# EAGLE design PC-FX (EAGLE 9.6.2)
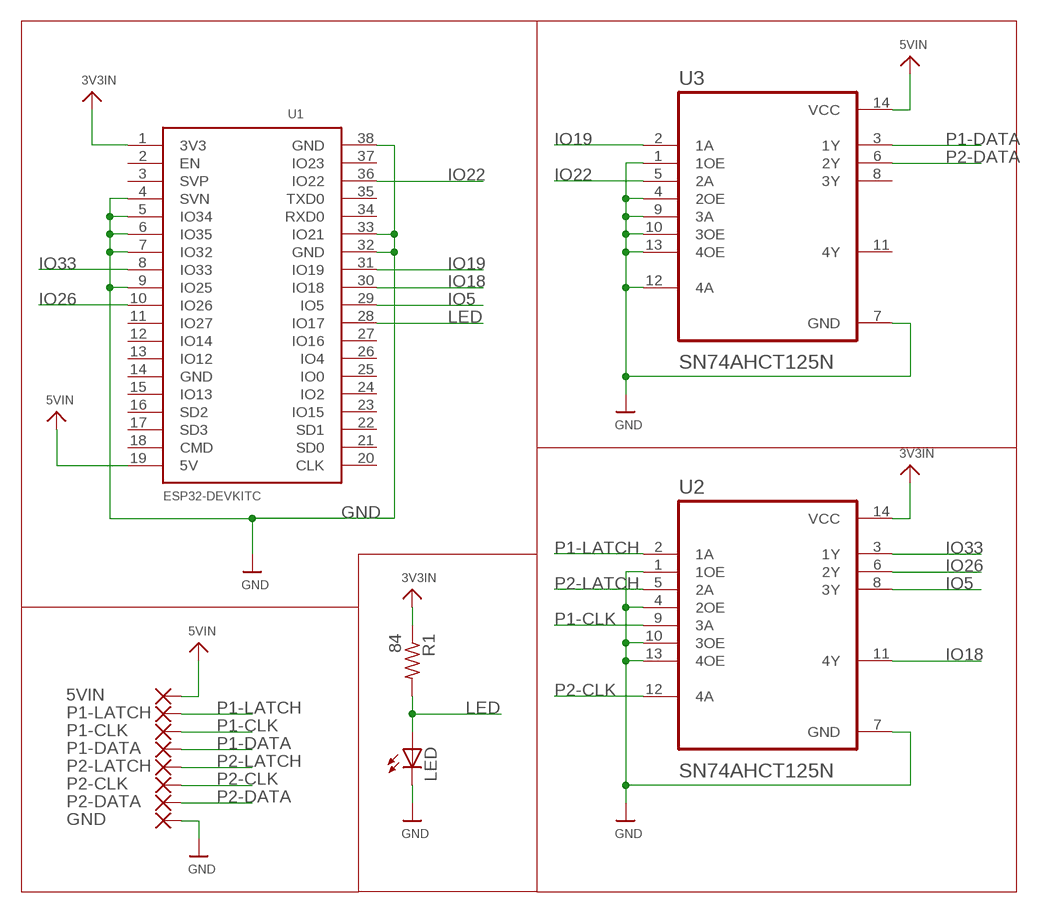
[diagram p0: schematic, sheet 1]

## Parts
5VIN  SMD5  [SMD2,54-5,08]
GND  SMD5  [SMD2,54-5,08]
LED  LEDCHIPLED_1206  [CHIPLED_1206]
P1-CLK  SMD5  [SMD2,54-5,08]
P1-DATA  SMD5  [SMD2,54-5,08]
P1-LATCH  SMD5  [SMD2,54-5,08]
P2-CLK  SMD5  [SMD2,54-5,08]
P2-DATA  SMD5  [SMD2,54-5,08]
P2-LATCH  SMD5  [SMD2,54-5,08]
R1  84  R-US_R1206  [R1206]
U1  ESP32DEVKITC  [ESP32-DEVKITC]
U2  SN74AHCT125N  [DIP794W45P254L1969H508Q14]
U3  SN74AHCT125N  [DIP794W45P254L1969H508Q14]

## Nets
3V3IN: R1.1 U1.1(3V3) U2.14(VCC)
5VIN: 5VIN.1(P) U1.19(5V) U3.14(VCC)
GND: GND.1(P) LED.C U1.4(SVN) U1.5(IO34) U1.6(IO35) U1.7(IO32) U1.9(IO25) U1.32(GND) U1.33(IO21) U1.38(GND) U2.1(1OE) U2.4(2OE) U2.7(GND) U2.10(3OE) U2.13(4OE) U3.1(1OE) U3.4(2OE) U3.7(GND) U3.9(3A) U3.10(3OE) U3.12(4A) U3.13(4OE)
IO5: U1.29(IO5) U2.8(3Y)
IO18: U1.30(IO18) U2.11(4Y)
IO19: U1.31(IO19) U3.2(1A)
IO22: U1.36(IO22) U3.5(2A)
IO26: U1.10(IO26) U2.6(2Y)
IO33: U1.8(IO33) U2.3(1Y)
LED: LED.A R1.2 U1.28(IO17)
P1-CLK: P1-CLK.1(P) U2.9(3A)
P1-DATA: P1-DATA.1(P) U3.3(1Y)
P1-LATCH: P1-LATCH.1(P) U2.2(1A)
P2-CLK: P2-CLK.1(P) U2.12(4A)
P2-DATA: P2-DATA.1(P) U3.6(2Y)
P2-LATCH: P2-LATCH.1(P) U2.5(2A)
Unconnected: U1.2(EN) U1.3(SVP) U1.11(IO27) U1.12(IO14) U1.13(IO12) U1.14(GND) U1.15(IO13) U1.16(SD2) U1.17(SD3) U1.18(CMD) U1.20(CLK) U1.21(SD0) U1.22(SD1) U1.23(IO15) U1.24(IO2) U1.25(IO0) U1.26(IO4) U1.27(IO16) U1.34(RXD0) U1.35(TXD0) U1.37(IO23) U3.8(3Y) U3.11(4Y)

## Library data of the parts
5VIN GND P1-CLK P1-DATA P1-LATCH P2-CLK P2-DATA P2-LATCH = wirepad:SMD5: SMD PAD
LED = adafruit:LED: LED OSRAM: - CHIPLED LG R971, LG N971, LY N971, LG Q971, LY Q971, LO R971, LY R971 LH N974, LH R974 LS Q976, LO Q976, LY Q976 LO Q996 - Hyper CHIPLED LW Q18S LB Q993, LB Q99A, LB R99A - SideLED LS A670, LO A670, LY A670, LG A670, LP A670 LB A673, LV A673, LT A673, LW A673 LH A674 LY A675 LS A676, LA A676, LO A676, LY A676, LW A676 LS A679, LY A679, LG A679 - Hyper Micro SIDELED® LS Y876, LA Y876, LO Y876, LY Y876 LT Y87S - SmartLED LW L88C, LW L88S LB L89C, LB L89S, LG L890 LS L89K, LO L89K, LY L89K LS L896, LA L896, LO L896, LY L896 - TOPLED LS T670, LO T670, LY T670, LG T670, LP T670 LSG T670, LSP T670, LSY T670, LOP T670, LYG T670 LG T671, LOG T671, LSG T671 LB T673, LV T673, LT T673, LW T673 LH T674 LS T676, LA T676, LO T676, LY T676, LB T676, LH T676, LSB T676, LW T676 LB T67C, LV T67C, LT T67C, LS T67K, LO T67K, LY T67K, LW E67C LS E67B, LA E67B, LO E67B, LY E67B, LB E67C, LV E67C, LT E67C LW T67C LS T679, LY T679, LG T679 LS T770, LO T770, LY T770, LG T770, LP T770 LB T773, LV T773, LT T773, LW T773 LH T774 LS E675, LA E675, LY E675, LS T675 LS T776, LA T776, LO T776, LY T776, LB T776 LHGB T686 LT T68C, LB T68C - Hyper Mini TOPLED® LB M676 - Mini TOPLED Santana® LG M470 LS M47K, LO M47K, LY M47K Source: http://www.osram.convergy.de/
R1 = adafruit:R-US_: RESISTOR, American symbol
U1 = ESP32-DEVKITC:ESP32DEVKITC
U2 U3 = SN74AHCT125N:SN74AHCT125N: None Check prices <https://pricing.snapeda.com/parts/SN74AHCT125N/Texas%20Instruments/view-part?ref=eda>; AVAILABILITY: In Stock; DESCRIPTION: Quadruple Bus Buffer Gates With 3-State Outputs 14-PDIP -40 to 125; MF: Texas Instruments; MP: SN74AHCT125N; PACKAGE: PDIP-14 Texas Instruments; PRICE: None; PURCHASE-URL: https://pricing.snapeda.com/search/part/SN74AHCT125N/?ref=eda

## Board
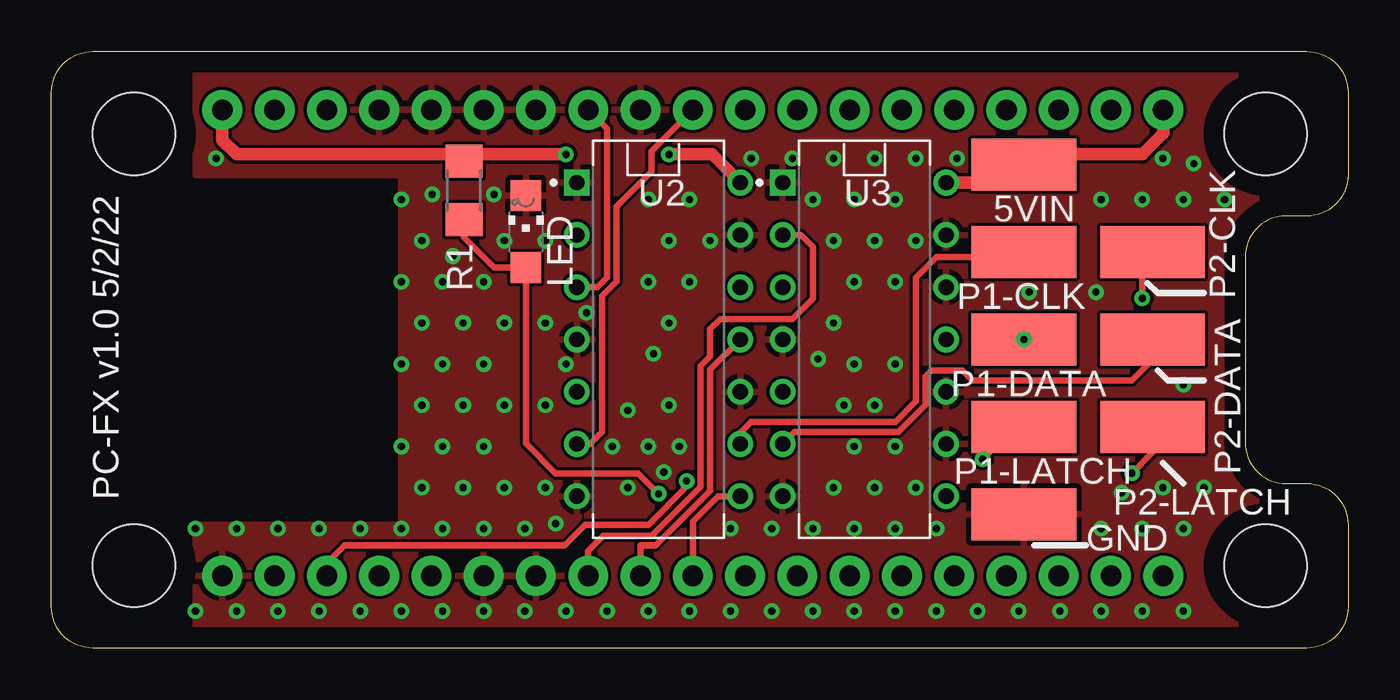
[diagram p1: board, top side]
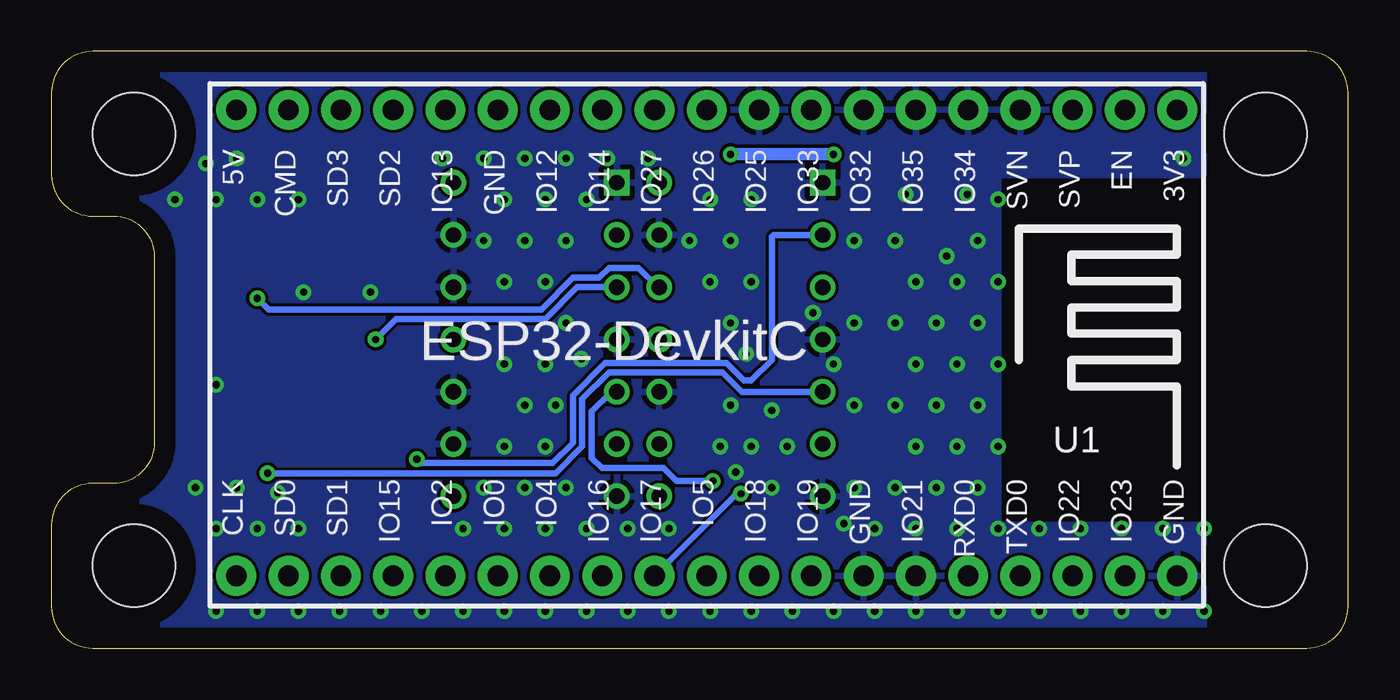
[diagram p2: board, bottom side, seen from below]

Size 63 x 29 mm. Coordinates in mm from the lower left corner, seen from the top.
Outline: 0,2 0,27 arc-90 2,29 61,29 arc-90 63,27 63,23 arc-90 61,21 60,21 arc90 58,19 58,10 arc90 60,8 61,8 arc-90 63,6 63,2 arc-90 61,0 2,0 arc-90 0,2
Copper layers (1*16): Top 0.035mm / dielectric 1.5mm / Bottom 0.035mm
Design rules "default": minimum track width 6mil, minimum drill 0.35mm, track to track 6mil, track to pad 6mil, pad to pad 6mil, via to via 6mil, smd to smd 6mil, copper to edge 40mil, drill to drill 6mil, minimum pad ring 10mil, minimum via ring 8mil, stop-mask expansion 4mil, vias tented up to drill 0.5mm, thermal gap 10mil
Holes 4 mm at 4,4 4,25 59,25 59,4

### Footprints (pad centres in the part's own frame; a part is rotated, then mirrored left to right if it is on the bottom)
SMD2,54-5,08 = smd 2.54 x 5.08: 1 0,0
CHIPLED_1206 = smd 1.5 x 1.5: A 0,-1.75; C 0,1.75
R1206 = smd 1.6 x 1.803: 1 -1.422,0; 2 1.422,0
ESP32-DEVKITC = drill 1 pad 1.93: 1 -22.87,-11.42; 2 -20.33,-11.42; 3 -17.79,-11.42; 4 -15.25,-11.42; 5 -12.71,-11.42; 6 -10.17,-11.42; 7 -7.63,-11.42; 8 -5.09,-11.42; 9 -2.55,-11.42; 10 -0.01,-11.42; 11 2.53,-11.42; 12 5.07,-11.42; 13 7.61,-11.42; 14 10.15,-11.42; 15 12.69,-11.42; 16 15.23,-11.42; 17 17.77,-11.42; 18 20.31,-11.42; 19 22.85,-11.42; 20 22.85,11.23; 21 20.31,11.23; 22 17.77,11.23; 23 15.23,11.23; 24 12.69,11.23; 25 10.15,11.23; 26 7.61,11.23; 27 5.07,11.23; 28 2.53,11.23; 29 -0.01,11.23; 30 -2.55,11.23; 31 -5.09,11.23; 32 -7.63,11.23; 33 -10.17,11.23; 34 -12.71,11.23; 35 -15.25,11.23; 36 -17.79,11.23; 37 -20.33,11.23; 38 -22.87,11.23
DIP794W45P254L1969H508Q14 = drill 0.74 pad 1.14 square: 1 -3.97,7.62 | drill 0.74 pad 1.14: 2 -3.97,5.08; 3 -3.97,2.54; 4 -3.97,0; 5 -3.97,-2.54; 6 -3.97,-5.08; 7 -3.97,-7.62; 8 3.97,-7.62; 9 3.97,-5.08; 10 3.97,-2.54; 11 3.97,0; 12 3.97,2.54; 13 3.97,5.08; 14 3.97,7.62

### Placement (x,y rotation side)
5VIN  47.25,23.5 90 top
GND  47.25,6.5 90 top
LED  23.05,20.24 0 top
P1-CLK  47.25,19.25 90 top
P1-DATA  47.25,15 90 top
P1-LATCH  47.25,10.75 90 top
P2-CLK  53.5,19.25 90 top
P2-DATA  53.5,15 90 top
P2-LATCH  53.5,10.75 90 top
R1  20.05,22.24 270 top
U1  31.17,14.74 180 bottom
U2  29.5,15 0 top
U3  39.5,15 0 top

### Tracks (layer width: path | path; a pad name or v marks a point on that pad's centre or on a via)
3V3IN  (via drill 0.35)
  Top 0.61: U1.1 8.3,24.7 9,24 19.71,24 R1.1 20.39,24 v25,24 | v30,24 32.09,24 U2.14
  Bottom 0.61: v25,24 v30,24
5VIN
  Top 0.61: U1.19 54.02,25.02 53,24 47,24 47,23.75 5VIN.1 46.37,22.62 U3.14
GND  (via drill 0.35)
  other vias: 7,1.8 7,5.8 9,1.8 9,5.8 8,23.8 11,1.8 11,5.8 13,1.8 13,5.8 15,1.8 15,5.8 17,1.8 17,5.8 17,9.8 17,13.8 17,17.8 17,21.8 19,1.8 19,5.8 18,7.8 19,9.8 18,11.8 19,13.8 18,15.8 19,17.8 18,19.8 18.5,22.05 21,1.8 21,5.8 20,7.8 21,9.8 20,11.8 21,13.8 20,15.8 21,17.8 19.5,19.05 21.5,22.05 23,1.8 23,5.8 22,7.8 22,11.8 22,15.8 22,19.8 25,1.8 24.5,6.05 24,7.8 24,11.8 25,13.8 24,15.8 24,19.8 27,1.8 27.25,9.8 26,16.3 29,1.8 28,7.8 29,9.8 28,11.55 29.25,14.3 29,17.8 29,21.8 31,1.8 29.75,8.55 30.5,9.8 30,11.8 30,15.8 31,17.8 30,19.8 31,21.8 33,1.8 33,5.8 32,19.8 35,1.8 35,5.8 34,23.8 37,1.8 37,5.8 37.25,14.05 37,21.8 36,23.8 39,1.8 39,5.8 38,7.8 39,9.8 38.5,11.8 39,13.8 38,15.8 39,17.8 38,19.8 39,21.8 38,23.8 41,1.8 41,5.8 40,7.8 41,9.8 40,11.8 41,13.8 41,17.8 40,19.8 41,21.8 40,23.8 43,1.8 43,5.8 42,7.8 42,19.8 42,23.8 45,1.8 44,23.8 47,1.8 49,1.8 51,1.8 51,5.8 55,12.8 50.75,17.3 47.5,17.3 51,21.8 53,1.8 53,5.8 52,7.55 53,21.8 55,1.8 55,5.8 54,7.8 55,21.8 54,23.8 56,7.8 57,21.8 55.5,23.55
  pour Top: 7,29 7,23 17,23 17,6 7,6 7,0 63,0 63,29
  pour Bottom: 7,0 63,0 63,29 7,29 7,23 17,23 17,6 7,6
IO5
  Top 0.305: U1.29 31.16,6 31.16,6.16 32.38,7.38 U2.8
IO18
  Top 0.305: U1.30 28.62,5 29.35,5 32,7.65 32,13.53 U2.11
IO19
  Top 0.305: U1.31 26.08,4.73 26.81,5.46 29.16,5.46 31.54,7.84 31.54,13.72 32,14.18 32,15.5 32.5,16 36,16 37,17 37,19.5 36.42,20.08 U3.2
IO22  (via drill 0.35)
  Top 0.305: U1.36 13.38,4.13 14.25,5 24.92,5 25.92,6 29,6 30.86,7.86 v30.86,8.12
  Bottom 0.305: v30.86,8.12 32.62,8.12 33.25,8.75 36.25,8.75 36.75,9.25 36.75,11.5 35.79,12.46 U3.5
IO26
  Top 0.305: U2.6 26.17,9.92 26.75,10.5 26.75,17.1 27.46,17.81 27.46,21.46 29.16,23.16 29.16,24.16 U1.10
IO33
  Top 0.305: U2.3 26.54,17.54 27,18 27,25.24 U1.8
LED  (via drill 0.35)
  Top 0.305: R1.2 20.05,19.95 21.51,18.49 LED.A 23.05,9.95 24.5,8.5 28.5,8.5 v29.5,7.5
  Bottom 0.305: U1.28 32.1,5.11 29.71,7.5 v29.5,7.5
P1-CLK
  Top 0.305: U2.9 33.47,10.47 34,11 41,11 42,12 42,18 43,19 47,19 P1-CLK.1
P1-DATA  (via drill 0.35)
  Bottom 0.305: U3.3 37.46,17.54 39,16 46.25,16 P1-DATA.1
  other vias: 47.25,15
P1-LATCH  (via drill 0.35)
  Top 0.305: v45.25,9.18 46.82,10.75 P1-LATCH.1
  Bottom 0.305: U2.2 27.92,20.08 28,20 28,14 29,13 29.35,13 30.2,13.85 36.1,13.85 37.66,12.29 37.66,9.98 38.66,8.99 45.06,8.99 v45.25,9.18
P2-CLK  (via drill 0.35)
  Top 0.305: v53,17 53,18.75 P2-CLK.1
  Bottom 0.305: U2.12 33.54,17.54 34.47,18.47 35.91,18.47 36.39,18 37,18 37.25,18 37.65,18 39.19,16.46 52.46,16.46 v53,17
P2-DATA
  Top 0.305: U3.6 36.11,10.5 41.15,10.5 42.46,11.81 42.46,13.21 42.75,13.5 44.25,13.5 44.75,13 52.5,13 53.5,14 P2-DATA.1
P2-LATCH  (via drill 0.35)
  Top 0.305: P2-LATCH.1 53.5,9.5 v52.5,8.5
  Bottom 0.305: U2.5 29.46,12.46 30.39,13.39 35.91,13.39 37.21,12.1 37.21,9.79 38.5,8.5 v52.5,8.5

### Text on the board
tNames: PC-FX v1.0 5/2/22